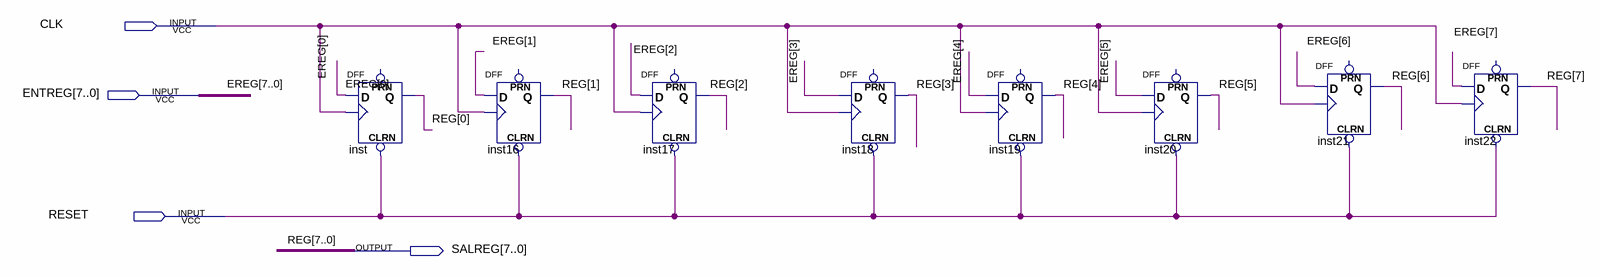
[diagram p0: schematic sheet]
// Quartus schematic REGPRO.bdf as structural Verilog: 8 symbols, 4 pins
module REGPRO (
  input  CLK,
  input  [7:0] ENTREG,
  input  RESET,
  output [7:0] SALREG
);

  DFF inst (.CLRN(RESET), .CLK(CLK), .D(ENTREG[0]), .Q(SALREG[0]));  // open: PRN
  DFF inst16 (.CLRN(RESET), .CLK(CLK), .D(ENTREG[1]), .Q(SALREG[1]));  // open: PRN
  DFF inst17 (.CLRN(RESET), .CLK(CLK), .D(ENTREG[2]), .Q(SALREG[2]));  // open: PRN
  DFF inst18 (.CLRN(RESET), .CLK(CLK), .D(ENTREG[3]), .Q(SALREG[3]));  // open: PRN
  DFF inst19 (.CLRN(RESET), .CLK(CLK), .D(ENTREG[4]), .Q(SALREG[4]));  // open: PRN
  DFF inst20 (.CLRN(RESET), .CLK(CLK), .D(ENTREG[5]), .Q(SALREG[5]));  // open: PRN
  DFF inst21 (.CLRN(RESET), .CLK(CLK), .D(ENTREG[6]), .Q(SALREG[6]));  // open: PRN
  DFF inst22 (.CLRN(RESET), .CLK(CLK), .D(ENTREG[7]), .Q(SALREG[7]));  // open: PRN

  // Other names for the same wires on the sheet: EREG[7:0] = ENTREG; REG[7:0] = SALREG
endmodule
